# EAGLE schematic basic (EAGLE 8.3.2)
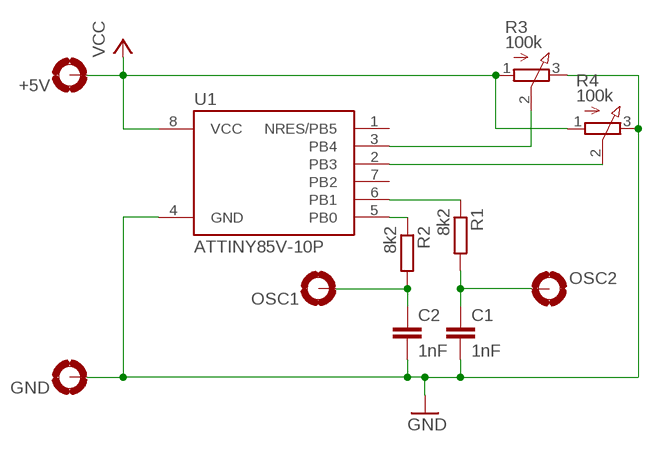
[diagram p0: schematic, sheet 1]

## Parts
+5V  MOUNT-PAD-ROUND3.0  [3,0-PAD]
C1  1nF  C2.5/4  [C2.5-4]
C2  1nF  C2.5/4  [C2.5-4]
GND  MOUNT-PAD-ROUND3.0  [3,0-PAD]
OSC1  MOUNT-PAD-ROUND3.0  [3,0-PAD]
OSC2  MOUNT-PAD-ROUND3.0  [3,0-PAD]
R1  8k2  R0207/10  [0207/10]
R2  8k2  R0207/10  [0207/10]
R3  100k  3RP/1610N  [3RP/1610N]
R4  100k  3RP/1610N  [3RP/1610N]
U1  ATTINY85V-10P  [PDIP08_300MIL]

## Nets
GND: C1.2 C2.2 GND.B3,0(MOUNT) R3.3(E) R4.3(E) U1.4(GND)
N$1: R2.1 U1.5(PB0)
N$2: R1.1 U1.6(PB1)
N$3: R3.2(S) U1.3(PB4)
N$4: C1.1 OSC2.B3,0(MOUNT) R1.2
N$6: R4.2(S) U1.2(PB3)
N$7: C2.1 OSC1.B3,0(MOUNT) R2.2
VCC: +5V.B3,0(MOUNT) R3.1(A) R4.1(A) U1.8(VCC)
Unconnected: U1.1(NRES/PB5) U1.7(PB2)

## Library data of the parts
+5V GND OSC1 OSC2 = holes:MOUNT-PAD-ROUND: MOUNTING PAD, round
C1 C2 = capacitor-wima:C: CAPACITOR naming: grid - package width
R1 R2 = eagle-ltspice:R: RESISTOR, European symbol; SPICEMODEL: NONE; SPICEPREFIX: R
R3 R4 = pot:3RP/1610N: 16mm Potentiometer one level Source: http://www.alphapotentiometers.net/html/16mm_pot_2.html
U1 = _hhn_attiny25_45_85:ATTINY85*: ATMEL ATtiny 85 Packages: P = PDIP 08 30mil S = SOIC 08 EIAJ 208mil Technologies Note: for complete ordering code (temp. range, finish, tape&reel etc.) see www.atmel.com • Supply Voltage: V = (1.8…5.5)V | [blank] = (2.7…5.5)V • Speed: 10 = 10 MHz | 20 = 20 MHz Author: Dipl.-Ing. FH Rainer Bayer HHN Hochschule Heilbronn (Heilbronn University), rainer.bayer@hs-heilbronn.de Ingenieurbüro ing-rb, mail@ing-rb.de